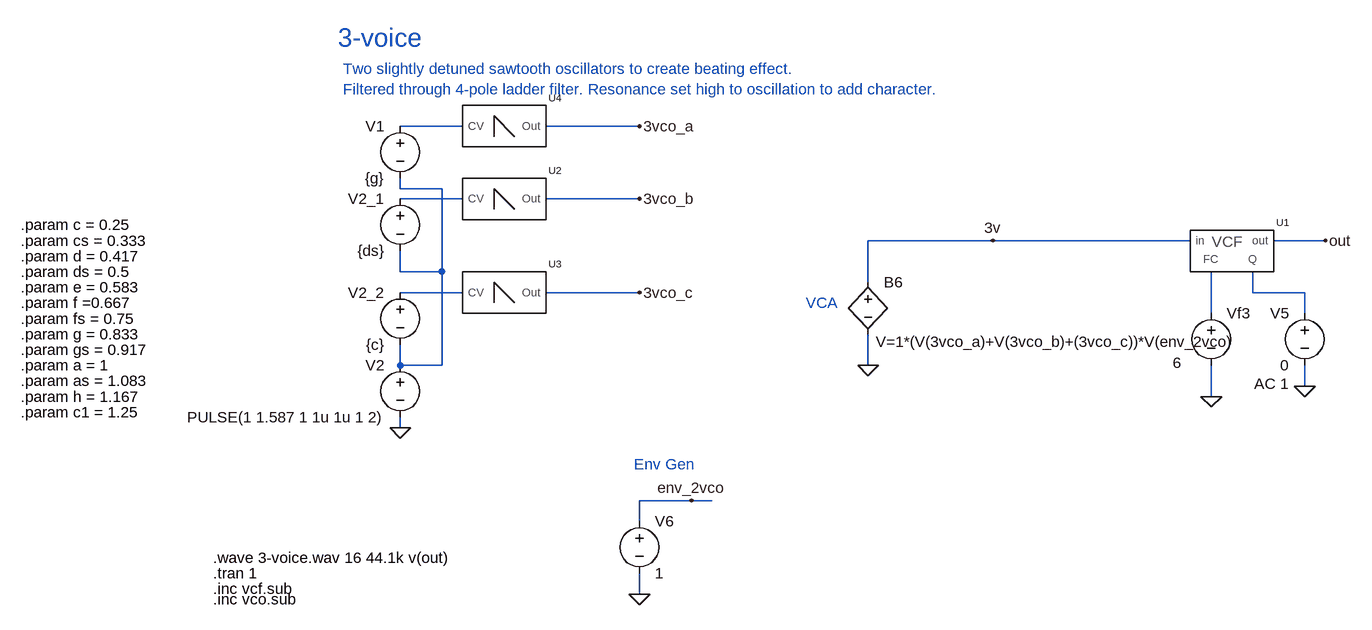
[diagram p0: schematic 3-voice.asc]
3-voice.asc, the LTspice schematic file:
Version 4
SHEET 1 1536 5468
WIRE -1616 112 -1712 112
WIRE -1344 112 -1488 112
WIRE -1712 208 -1712 192
WIRE -1648 208 -1712 208
WIRE -1616 224 -1712 224
WIRE -1344 224 -1488 224
WIRE -800 288 -992 288
WIRE -496 288 -800 288
WIRE -288 288 -368 288
WIRE -1712 336 -1712 304
WIRE -1648 336 -1648 208
WIRE -1648 336 -1712 336
WIRE -992 352 -992 288
WIRE -1616 368 -1712 368
WIRE -1344 368 -1488 368
WIRE -400 368 -400 336
WIRE -320 368 -400 368
WIRE -464 400 -464 336
WIRE -320 400 -320 368
WIRE -1712 480 -1712 448
WIRE -1648 480 -1648 336
WIRE -1648 480 -1712 480
WIRE -992 480 -992 432
WIRE -320 512 -320 480
WIRE -464 528 -464 480
WIRE -1712 576 -1712 560
WIRE -1264 688 -1344 688
WIRE -1232 688 -1264 688
WIRE -1344 720 -1344 688
WIRE -1344 832 -1344 800
FLAG -992 480 0
FLAG -1344 224 3vco_b
FLAG -800 288 3v
FLAG -1344 368 3vco_c
FLAG -1344 832 0
FLAG -1264 688 env_2vco
FLAG -288 288 out
FLAG -320 512 0
FLAG -464 528 0
FLAG -1344 112 3vco_a
FLAG -1712 576 0
SYMBOL bv -992 336 R0
WINDOW 3 12 108 Left 2
SYMATTR Value V=1*(V(3vco_a)+V(3vco_b)+(3vco_c))*V(env_2vco)
SYMATTR InstName B6
SYMBOL voltage -1712 352 M0
WINDOW 39 0 0 Left 2
SYMATTR InstName V2_2
SYMATTR Value {c}
SYMBOL voltage -1712 208 M0
WINDOW 123 24 124 Left 2
WINDOW 39 0 0 Left 2
SYMATTR InstName V2_1
SYMATTR Value {ds}
SYMBOL voltage -464 384 R0
WINDOW 123 0 0 Left 0
WINDOW 39 0 0 Left 0
WINDOW 3 -59 92 Left 2
SYMATTR Value 6
SYMATTR InstName Vf3
SYMBOL voltage -1344 704 R0
WINDOW 123 0 0 Left 0
WINDOW 39 0 0 Left 0
SYMATTR InstName V6
SYMATTR Value 1
SYMBOL vcf -432 256 R0
SYMATTR InstName U1
SYMBOL voltage -320 384 M0
WINDOW 123 24 124 Left 2
WINDOW 39 0 0 Left 2
SYMATTR Value2 AC 1
SYMATTR InstName V5
SYMATTR Value 0
SYMBOL vco -1552 176 R0
SYMATTR InstName U2
SYMBOL vco -1552 320 R0
SYMATTR InstName U3
SYMBOL voltage -1712 96 M0
WINDOW 123 24 124 Left 2
WINDOW 39 0 0 Left 2
SYMATTR InstName V1
SYMATTR Value {g}
SYMBOL vco -1552 64 R0
SYMATTR InstName U4
SYMBOL voltage -1712 464 M0
WINDOW 123 24 124 Left 2
WINDOW 39 0 0 Left 2
SYMATTR InstName V2
SYMATTR Value PULSE(1 1.587 1 1u 1u 1 2)
TEXT -2000 800 Left 2 !.tran 1
TEXT -2000 776 Left 2 !.wave 3-voice.wav 16 44.1k v(out)
TEXT -1088 384 Left 2 ;VCA
TEXT -1808 -24 Left 4 ;3-voice
TEXT -1800 24 Left 2 ;Two slightly detuned sawtooth oscillators to create beating effect.\nFiltered through 4-pole ladder filter. Resonance set high to oscillation to add character.
TEXT -1352 632 Left 2 ;Env Gen
TEXT -2000 824 Left 2 !.inc vcf.sub
TEXT -2000 840 Left 2 !.inc vco.sub
TEXT -2296 312 Left 2 !.param d = 0.417
TEXT -2296 336 Left 2 !.param ds = 0.5
TEXT -2296 360 Left 2 !.param e = 0.583
TEXT -2296 384 Left 2 !.param f =0.667
TEXT -2296 408 Left 2 !.param fs = 0.75
TEXT -2296 432 Left 2 !.param g = 0.833
TEXT -2296 456 Left 2 !.param gs = 0.917
TEXT -2296 480 Left 2 !.param a = 1
TEXT -2296 504 Left 2 !.param as = 1.083
TEXT -2296 528 Left 2 !.param h = 1.167
TEXT -2296 288 Left 2 !.param cs = 0.333
TEXT -2296 264 Left 2 !.param c = 0.25
TEXT -2296 552 Left 2 !.param c1 = 1.25

The netlist it stands for:
* 3-voice.asc
B6 3v 0 V=1*(V(3vco_a)+V(3vco_b)+(3vco_c))*V(env_2vco)
V2_2 N004 N002 {c}
V2_1 N003 N002 {ds}
Vf3 N006 0 6
V6 env_2vco 0 1
XU1 3v out N006 N005 vcf  ; pins in out FC Q
V5 N005 0 0 AC 1
XU2 N003 3vco_b vco  ; pins CV Out
XU3 N004 3vco_c vco  ; pins CV Out
V1 N001 N002 {g}
XU4 N001 3vco_a vco  ; pins CV Out
V2 N002 0 PULSE(1 1.587 1 1u 1u 1 2)
.tran 1
.wave 3-voice.wav 16 44.1k v(out)
* VCA
* 3-voice
* Two slightly detuned sawtooth oscillators to create beating effect.
* Filtered through 4-pole ladder filter. Resonance set high to oscillation to add character.
* Env Gen
.inc vcf.sub
.inc vco.sub
.param d = 0.417
.param ds = 0.5
.param e = 0.583
.param f =0.667
.param fs = 0.75
.param g = 0.833
.param gs = 0.917
.param a = 1
.param as = 1.083
.param h = 1.167
.param cs = 0.333
.param c = 0.25
.param c1 = 1.25
.backanno
.end